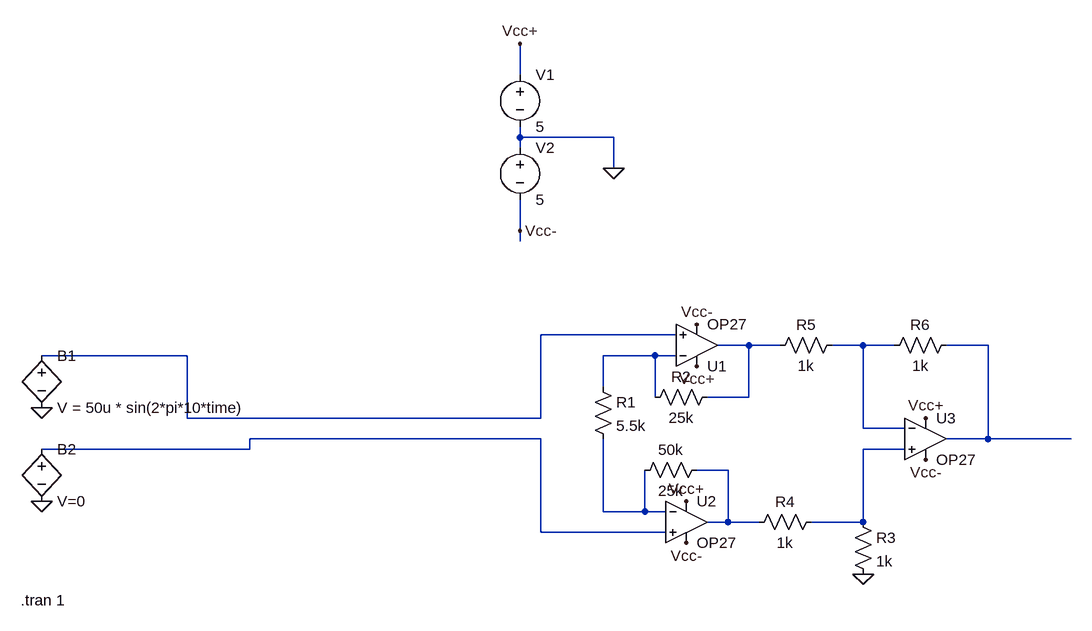
[diagram p0: schematic INA10x(version2).asc]
INA10x(version2).asc, the LTspice schematic file:
Version 4.1
SHEET 1 1604 680
WIRE 752 -352 752 -400
WIRE 752 -256 752 -272
WIRE 896 -256 752 -256
WIRE 752 -240 752 -256
WIRE 896 -208 896 -256
WIRE 752 -112 752 -160
WIRE 752 -96 752 -112
WIRE 992 48 784 48
WIRE 1104 64 1056 64
WIRE 1152 64 1104 64
WIRE 1280 64 1232 64
WIRE 1328 64 1280 64
WIRE 1472 64 1408 64
WIRE 240 80 16 80
WIRE 960 80 880 80
WIRE 992 80 960 80
WIRE 880 128 880 80
WIRE 960 144 960 80
WIRE 1104 144 1104 64
WIRE 1104 144 1040 144
WIRE 240 176 240 80
WIRE 784 176 784 48
WIRE 784 176 240 176
WIRE 1280 192 1280 64
WIRE 1344 192 1280 192
WIRE 784 208 336 208
WIRE 1472 208 1472 64
WIRE 1472 208 1408 208
WIRE 1600 208 1472 208
WIRE 336 224 336 208
WIRE 336 224 16 224
WIRE 1344 224 1280 224
WIRE 1072 256 1024 256
WIRE 880 320 880 208
WIRE 944 320 944 256
WIRE 944 320 880 320
WIRE 976 320 944 320
WIRE 1072 336 1072 256
WIRE 1072 336 1040 336
WIRE 1120 336 1072 336
WIRE 1280 336 1280 224
WIRE 1280 336 1200 336
WIRE 784 352 784 208
WIRE 976 352 784 352
FLAG 896 -208 0
FLAG 752 -400 Vcc+
FLAG 752 -112 Vcc-
FLAG 16 160 0
FLAG 16 304 0
FLAG 1024 96 Vcc+
FLAG 1008 304 Vcc+
FLAG 1376 176 Vcc+
FLAG 1376 240 Vcc-
FLAG 1024 32 Vcc-
FLAG 1008 368 Vcc-
FLAG 1280 416 0
SYMBOL bv 16 64 R0
SYMATTR InstName B1
SYMATTR Value V = 50u * sin(2*pi*10*time)
SYMBOL bv 16 208 R0
SYMATTR InstName B2
SYMATTR Value V=0
SYMBOL voltage 752 -368 R0
SYMATTR InstName V1
SYMATTR Value 5
SYMBOL voltage 752 -256 R0
SYMATTR InstName V2
SYMATTR Value 5
SYMBOL OpAmps\\OP27 1024 128 M180
SYMATTR InstName U1
SYMBOL OpAmps\\OP27 1008 272 R0
SYMATTR InstName U2
SYMBOL OpAmps\\OP27 1376 144 R0
SYMATTR InstName U3
SYMBOL res 864 112 R0
SYMATTR InstName R1
SYMATTR Value 5.5k
SYMBOL res 1056 128 R90
WINDOW 0 0 56 VBottom 2
WINDOW 3 32 56 VTop 2
SYMATTR InstName R2
SYMATTR Value 25k
SYMBOL res 1040 240 R90
WINDOW 0 0 56 VBottom 2
WINDOW 3 32 56 VTop 2
SYMATTR InstName 50k
SYMATTR Value 25k
SYMBOL res 1216 320 R90
WINDOW 0 0 56 VBottom 2
WINDOW 3 32 56 VTop 2
SYMATTR InstName R4
SYMATTR Value 1k
SYMBOL res 1248 48 R90
WINDOW 0 0 56 VBottom 2
WINDOW 3 32 56 VTop 2
SYMATTR InstName R5
SYMATTR Value 1k
SYMBOL res 1424 48 R90
WINDOW 0 0 56 VBottom 2
WINDOW 3 32 56 VTop 2
SYMATTR InstName R6
SYMATTR Value 1k
SYMBOL res 1264 320 R0
SYMATTR InstName R3
SYMATTR Value 1k
TEXT -16 456 Left 2 !.tran 1

The netlist it stands for:
* INA10x(version2).asc
B1 N001 0 V = 50u * sin(2*pi*10*time)
B2 N006 0 V=0
V1 Vcc+ 0 5
V2 0 Vcc- 5
X§U1 N001 N005 Vcc+ Vcc- N002 OP27  ; pins In+ In- V+ V- OUT
X§U2 N006 N009 Vcc+ Vcc- N008 OP27  ; pins In+ In- V+ V- OUT
X§U3 N007 N003 Vcc+ Vcc- N004 OP27  ; pins In+ In- V+ V- OUT
R1 N005 N009 5.5k
R2 N002 N005 25k
R§50k N008 N009 25k
R4 N007 N008 1k
R5 N003 N002 1k
R6 N004 N003 1k
R3 N007 0 1k
.tran 1
.lib ADI.lib
.backanno
.end